# EAGLE design PCB_Draft_4 (EAGLE 9.6.2)
AUTHOR: R. Hall, A. Singh, K.Quizon; BOARD_NAME: ESP32 I2C Exp / M Driver; DOC_NUM: 0; PROJECT_NAME: R8-O7 PCB; REVISION: 6
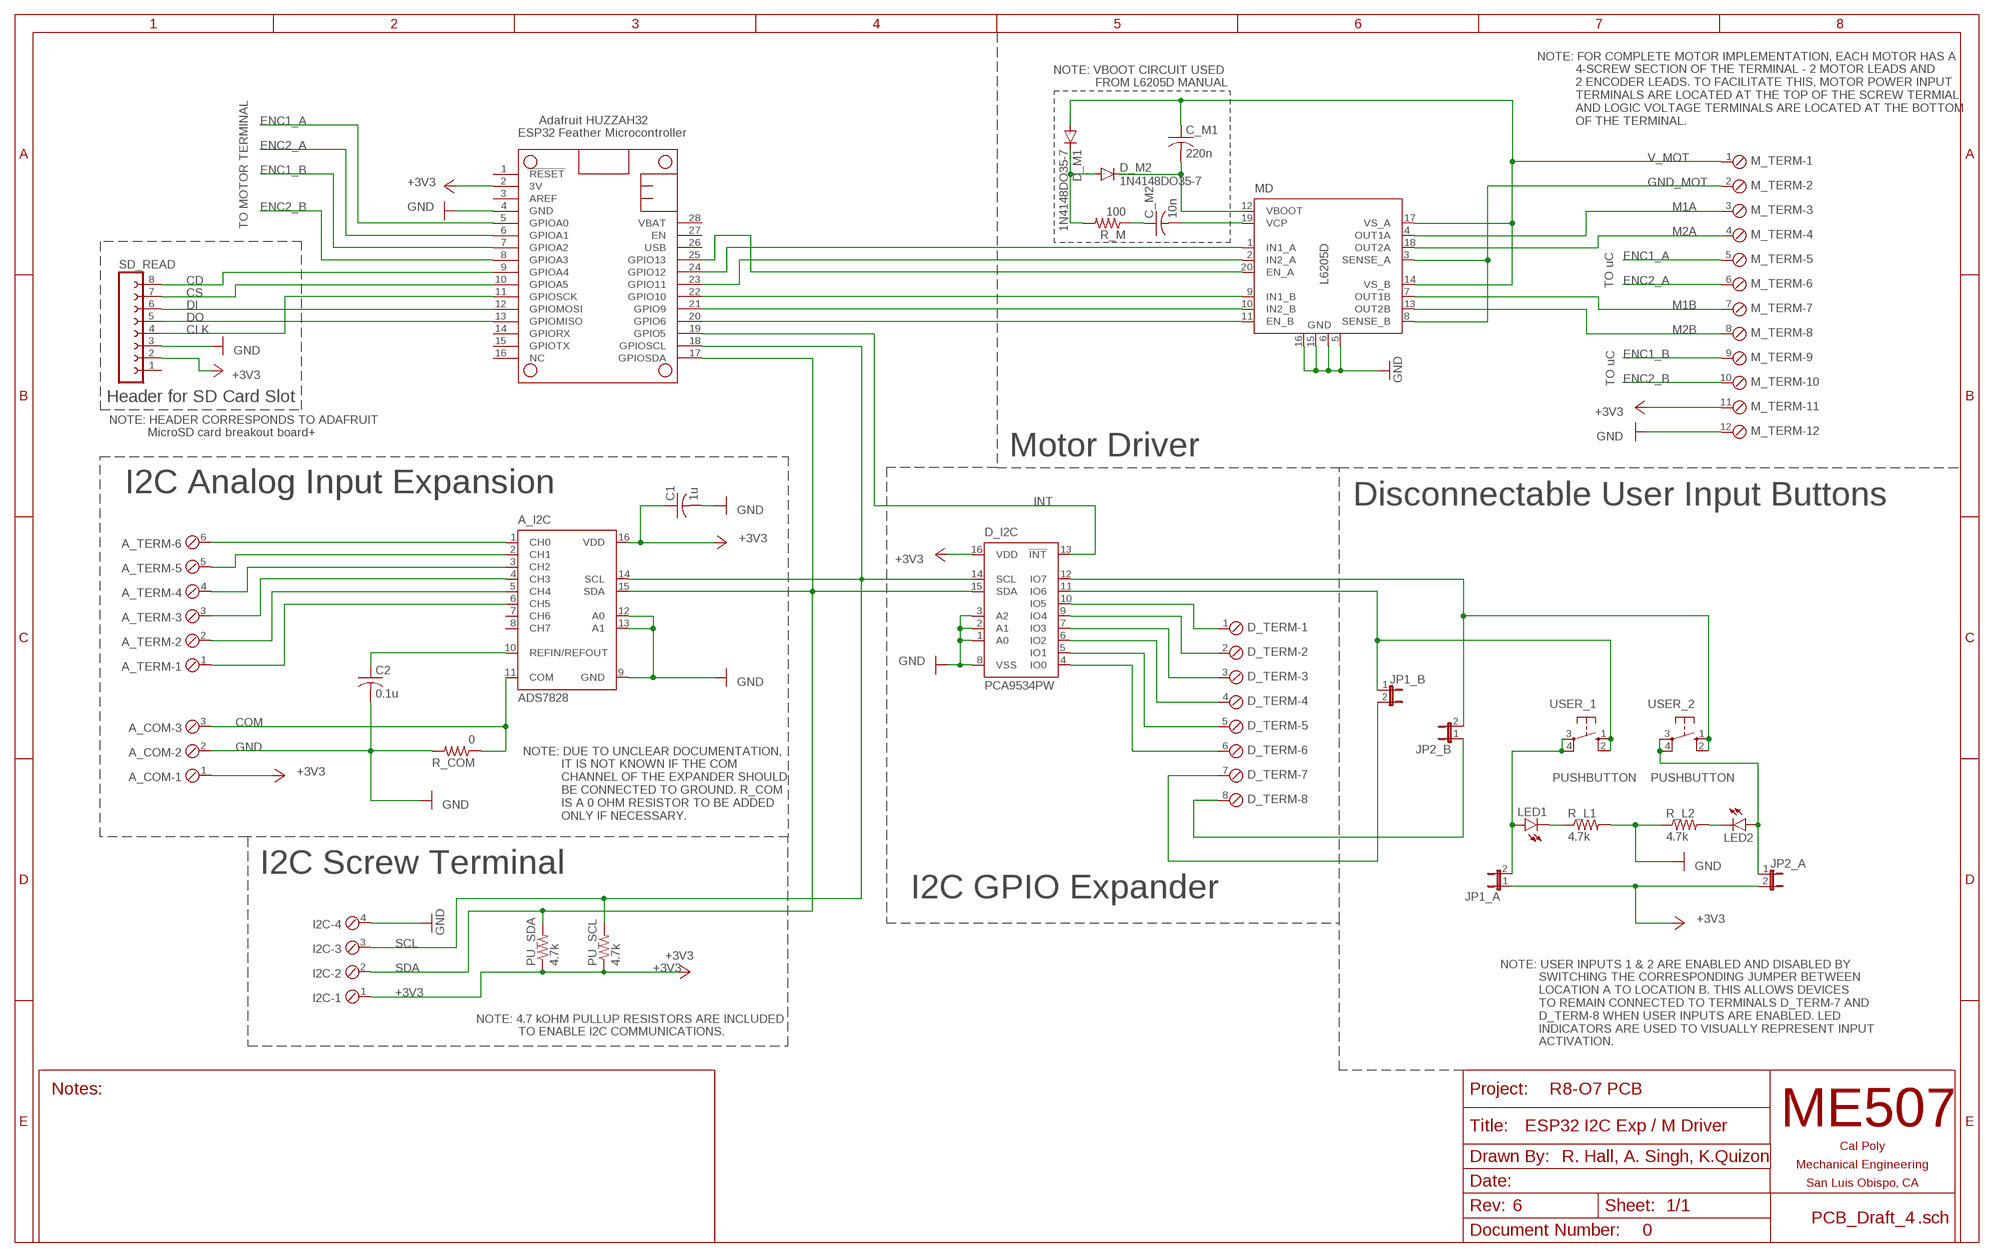
[diagram p0: schematic, sheet 1]

## Parts
A_COM  SCREWTERM_3P_254  [3POL254]
A_I2C  ADS7828  [TSSOP16-PW]
A_TERM  SCREWTERM_6P_254  [6POL254]
C1  1u  C-USC0805  [C0805]
C2  0.1u  C-USC0805  [C0805]
C_M1  220n  C-USC0805  [C0805]
C_M2  10n  C-USC0805  [C0805]
D_I2C  PCA9534PW  [TSSOP16]
D_M1  1N4148DO35-7  [DO35-7]
D_M2  1N4148DO35-7  [DO35-7]
D_TERM  SCREWTERM_8P_254  [8POL254]
FTHRWNG  FEATHERWINGEXTENDED_BOTH_ENDS  [FEATHERWING]
I2C  SCREWTERM_4P_254  [4POL254]
JP1_A  JP1E  [JP1]
JP1_B  JP1E  [JP1]
JP2_A  JP1E  [JP1]
JP2_B  JP1E  [JP1]
LED1  LEDCHIP-LED0805  [CHIP-LED0805]
LED2  LEDCHIP-LED0805  [CHIP-LED0805]
M_TERM  SCREWTERM_12P_254  [12POL254]
MD  L6205D  [SO20]
PU_SCL  4.7k  R-US_M0805  [M0805]
PU_SDA  4.7k  R-US_M0805  [M0805]
R_COM  0  R-US_M0805  [M0805]
R_L1  4.7k  R-US_M0805  [M0805]
R_L2  4.7k  R-US_M0805  [M0805]
R_M  100  R-US_M0805  [M0805]
SD_READ  FE08-1  [FE08]
USER_1  PUSHBUTTON  [B3F-10XX]
USER_2  PUSHBUTTON  [B3F-10XX]

## Nets
+3V3: A_COM.1 A_I2C.16(VDD) C1.1 D_I2C.16(VDD) FTHRWNG.2(3V) I2C.1 JP1_A.1 JP2_A.2 M_TERM.11 PU_SCL.1 PU_SDA.1 SD_READ.2
CD: FTHRWNG.9(GPIOA4) SD_READ.8
CLK: FTHRWNG.11(GPIOSCK) SD_READ.4
COM: A_COM.3 A_I2C.11(COM) R_COM.1
CS: FTHRWNG.10(GPIOA5) SD_READ.7
DI: FTHRWNG.12(GPIOMOSI) SD_READ.6
DO: FTHRWNG.13(GPIOMISO) SD_READ.5
ENC1_A: FTHRWNG.5(GPIOA0) M_TERM.5
ENC1_B: FTHRWNG.7(GPIOA2) M_TERM.9
ENC2_A: FTHRWNG.6(GPIOA1) M_TERM.6
ENC2_B: FTHRWNG.8(GPIOA3) M_TERM.10
GND: A_COM.2 A_I2C.9(GND) A_I2C.12(A0) A_I2C.13(A1) C1.2 C2.2 D_I2C.1(A0) D_I2C.2(A1) D_I2C.3(A2) D_I2C.8(VSS) FTHRWNG.4(GND) I2C.4 M_TERM.12 MD.5(GND) MD.6(GND) MD.15(GND) MD.16(GND) R_COM.2 R_L1.2 R_L2.1 SD_READ.3
GND_MOT: M_TERM.2 MD.3(SENSE_A) MD.8(SENSE_B)
INT: D_I2C.13(!INT) FTHRWNG.19(GPIO5)
M1A: M_TERM.3 MD.4(OUT1A)
M1B: M_TERM.7 MD.7(OUT1B)
M2A: M_TERM.4 MD.18(OUT2A)
M2B: M_TERM.8 MD.13(OUT2B)
N$1: D_I2C.12(IO7) JP2_B.2 USER_2.1(S) USER_2.2(S1)
N$2: D_I2C.11(IO6) JP1_B.1 USER_1.1(S) USER_1.2(S1)
N$3: D_I2C.10(IO5) D_TERM.1
N$4: D_I2C.9(IO4) D_TERM.2
N$5: D_I2C.7(IO3) D_TERM.3
N$6: D_I2C.6(IO2) D_TERM.4
N$8: D_TERM.7 JP1_B.2
N$9: A_I2C.1(CH0) A_TERM.6
N$10: A_I2C.2(CH1) A_TERM.5
N$11: A_I2C.3(CH2) A_TERM.4
N$12: A_I2C.4(CH3) A_TERM.3
N$13: A_I2C.5(CH4) A_TERM.2
N$14: A_I2C.6(CH5) A_TERM.1
N$17: A_I2C.10(REFIN/REFOUT) C2.1
N$18: FTHRWNG.20(GPIO6) MD.11(EN_B)
N$20: FTHRWNG.21(GPIO9) MD.10(IN2_B)
N$21: FTHRWNG.22(GPIO10) MD.9(IN1_B)
N$22: FTHRWNG.23(GPIO11) MD.2(IN2_A)
N$23: FTHRWNG.24(GPIO12) MD.1(IN1_A)
N$25: FTHRWNG.25(GPIO13) MD.20(EN_A)
N$26: JP1_A.2 LED1.A USER_1.3(P) USER_1.4(P1)
N$27: JP2_A.1 LED2.A USER_2.3(P) USER_2.4(P1)
N$29: LED1.C R_L1.1
N$30: LED2.C R_L2.2
N$32: D_I2C.5(IO1) D_TERM.5
N$33: D_I2C.4(IO0) D_TERM.6
N$35: D_TERM.8 JP2_B.1
N$44: C_M2.1 R_M.1
N$45: D_M1.C D_M2.A R_M.2
SCL: A_I2C.14(SCL) D_I2C.14(SCL) FTHRWNG.18(GPIOSCL) I2C.3 PU_SCL.2
SDA: A_I2C.15(SDA) D_I2C.15(SDA) FTHRWNG.17(GPIOSDA) I2C.2 PU_SDA.2
V_MOT: C_M1.1 D_M1.A M_TERM.1 MD.14(VS_B) MD.17(VS_A)
VBOOT: C_M1.2 D_M2.C MD.12(VBOOT)
VCP: C_M2.2 MD.19(VCP)
Unconnected: A_I2C.7(CH6) A_I2C.8(CH7) FTHRWNG.1(!RESET) FTHRWNG.3(AREF) FTHRWNG.14(GPIORX) FTHRWNG.15(GPIOTX) FTHRWNG.16(NC) FTHRWNG.26(USB) FTHRWNG.27(EN) FTHRWNG.28(VBAT) SD_READ.1

## Notes on the sheet
- NOTE: VBOOT CIRCUIT USED 
              FROM L6205D MANUAL
- NOTE: FOR COMPLETE MOTOR IMPLEMENTATION, EACH MOTOR HAS A 
             4-SCREW SECTION OF THE TERMINAL - 2 MOTOR LEADS AND 
             2 ENCODER LEADS. TO FACILITATE THIS, MOTOR POWER INPUT 
             TERMINALS ARE LOCATED AT THE TOP OF THE SCREW TERMIAL 
             AND LOGIC VOLTAGE TERMINALS ARE LOCATED AT THE BOTTOM 
             OF THE TERMINAL.
- Adafruit HUZZAH32
  ESP32 Feather Microcontroller
- TO MOTOR TERMINAL
- TO uC
- TO uC
- Header for SD Card Slot
- NOTE: HEADER CORRESPONDS TO ADAFRUIT
             MicroSD card breakout board+
- Motor Driver
- I2C Analog Input Expansion
- Disconnectable User Input Buttons
- NOTE: DUE TO UNCLEAR DOCUMENTATION, 
             IT IS NOT KNOWN IF THE COM 
             CHANNEL OF THE EXPANDER SHOULD 
             BE CONNECTED TO GROUND. R_COM 
             IS A 0 OHM RESISTOR TO BE ADDED 
             ONLY IF NECESSARY.
- I2C Screw Terminal
- I2C GPIO Expander
- NOTE: 4.7 kOHM PULLUP RESISTORS ARE INCLUDED 
              TO ENABLE I2C COMMUNICATIONS.
- NOTE: USER INPUTS 1 & 2 ARE ENABLED AND DISABLED BY   
             SWITCHING THE CORRESPONDING JUMPER BETWEEN 
             LOCATION A TO LOCATION B. THIS ALLOWS DEVICES 
             TO REMAIN CONNECTED TO TERMINALS D_TERM-7 AND 
             D_TERM-8 WHEN USER INPUTS ARE ENABLED. LED 
             INDICATORS ARE USED TO VISUALLY REPRESENT INPUT 
             ACTIVATION.

## Library data of the parts
A_COM = ME507:SCREWTERM_3P: Screw Terminal Block This part is designed for a screw terminal connector. The 2.54mm (0.100 inch) foorprint can also be used for male or female pin headers such as those on most development boards. One can also solder wires directly into the holes, though this makes modifications or repairs to the system more inconvenient. Larger versions can carry more current.
A_I2C = burr-brown:ADS7828: 12-Bit, 8-Channel Sampling ANALOG-TO-DIGITAL CONVERTER with I2C? Interface Source: www.ti.com .. ADS7828.pdf; MF: TEXAS INSTRUMENTS; MPN: ADS7828E/250; OC_FARNELL: 1470338; OC_NEWARK: 74C7158
A_TERM = ME507:SCREWTERM_6P: Screw Terminal Block This part is designed for a screw terminal connector. The 2.54mm (0.100 inch) foorprint can also be used for male or female pin headers such as those on most development boards. One can also solder wires directly into the holes, though this makes modifications or repairs to the system more inconvenient. Larger versions can carry more current.
C1 C2 C_M1 C_M2 = rcl:C-US: CAPACITOR, American symbol; SPICEPREFIX: C
D_I2C = micro-philips:PCA9534: 8-bit I2C-bus and SMBus low power I/O port with interrupt Source: www.nxp.com .. PCA9534_3.pdf; MPN: PCA9534PW; OC_FARNELL: 1408285; OC_NEWARK: 18M7516
D_M1 D_M2 = diode:1N4148: DIODE high speed (Philips)
D_TERM = ME507:SCREWTERM_8P: Screw Terminal Block This part is designed for a screw terminal connector. The 2.54mm (0.100 inch) foorprint can also be used for male or female pin headers such as those on most development boards. One can also solder wires directly into the holes, though this makes modifications or repairs to the system more inconvenient. Larger versions can carry more current.
FTHRWNG = ME507:FEATHERWING: AdaFruitTM Feather Wing A modified version of a Featherwing, the add-on board for an AdaFruit(tm) Feather development board. There is a standard size version which is the same size as the Feather board on which the microcontroller hangs out. There is also an extended version, with each and longer by a quarter inch to allow for connectors such as screw terminals which aren't hidden under another board if this wing isn't on the top of the board stack. The pins are named in a generic fashion; these names do not necessarily correspond to Arduino or Python pin numbers. The designer must refer to the pinout diagram for each specific Feather board to find the functions of each pin.
I2C = ME507:SCREWTERM_4P: Screw Terminal Block This part is designed for a screw terminal connector. The 2.54mm (0.100 inch) foorprint can also be used for male or female pin headers such as those on most development boards. One can also solder wires directly into the holes, though this makes modifications or repairs to the system more inconvenient. Larger versions can carry more current.
JP1_A JP1_B JP2_A JP2_B = jumper:JP1E: JUMPER
LED1 LED2 = led:LED: LED OSRAM: - CHIPLED LG R971, LG N971, LY N971, LG Q971, LY Q971, LO R971, LY R971 LH N974, LH R974 LS Q976, LO Q976, LY Q976 LO Q996 - Hyper CHIPLED LW Q18S LB Q993, LB Q99A, LB R99A - SideLED LS A670, LO A670, LY A670, LG A670, LP A670 LB A673, LV A673, LT A673, LW A673 LH A674 LY A675 LS A676, LA A676, LO A676, LY A676, LW A676 LS A679, LY A679, LG A679 - Hyper Micro SIDELED® LS Y876, LA Y876, LO Y876, LY Y876 LT Y87S - SmartLED LW L88C, LW L88S LB L89C, LB L89S, LG L890 LS L89K, LO L89K, LY L89K LS L896, LA L896, LO L896, LY L896 - TOPLED LS T670, LO T670, LY T670, LG T670, LP T670 LSG T670, LSP T670, LSY T670, LOP T670, LYG T670 LG T671, LOG T671, LSG T671 LB T673, LV T673, LT T673, LW T673 LH T674 LS T676, LA T676, LO T676, LY T676, LB T676, LH T676, LSB T676, LW T676 LB T67C, LV T67C, LT T67C, LS T67K, LO T67K, LY T67K, LW E67C LS E67B, LA E67B, LO E67B, LY E67B, LB E67C, LV E67C, LT E67C LW T67C LS T679, LY T679, LG T679 LS T770, LO T770, LY T770, LG T770, LP T770 LB T773, LV T773, LT T773, LW T773 LH T774 LS E675, LA E675, LY E675, LS T675 LS T776, LA T776, LO T776, LY T776, LB T776 LHGB T686 LT T68C, LB T68C - Hyper Mini TOPLED® LB M676 - Mini TOPLED Santana® LG M470 LS M47K, LO M47K, LY M47K Source: http://www.osram.convergy.de LUXEON: - LUMILED® LXK2-PW12-R00, LXK2-PW12-S00, LXK2-PW14-U00, LXK2-PW14-V00 LXK2-PM12-R00, LXK2-PM12-S00, LXK2-PM14-U00 LXK2-PE12-Q00, LXK2-PE12-R00, LXK2-PE12-S00, LXK2-PE14-T00, LXK2-PE14-U00 LXK2-PB12-K00, LXK2-PB12-L00, LXK2-PB12-M00, LXK2-PB14-N00, LXK2-PB14-P00, LXK2-PB14-Q00 LXK2-PR12-L00, LXK2-PR12-M00, LXK2-PR14-Q00, LXK2-PR14-R00 LXK2-PD12-Q00, LXK2-PD12-R00, LXK2-PD12-S00 LXK2-PH12-R00, LXK2-PH12-S00 LXK2-PL12-P00, LXK2-PL12-Q00, LXK2-PL12-R00 Source: www.luxeon.com KINGBRIGHT: KA-3528ASYC Source: www.kingbright.com
M_TERM = ME507:SCREWTERM_12P: Screw Terminal Block This part is designed for a screw terminal connector. The 2.54mm (0.100 inch) foorprint can also be used for male or female pin headers such as those on most development boards. One can also solder wires directly into the holes, though this makes modifications or repairs to the system more inconvenient. Larger versions can carry more current.
MD = st-microelectronics:L6205: DUAL DMOS FULL BRIDGE MOTOR DRIVER; MPN: L6205D; OC_FARNELL: unknown; OC_NEWARK: 37M3487
PU_SCL PU_SDA R_COM R_L1 R_L2 R_M = rcl:R-US_: RESISTOR, American symbol; SPICEPREFIX: R
SD_READ = con-lsta:FE08-1: FEMALE HEADER; OC_FARNELL: unknown; OC_NEWARK: unknown
USER_1 USER_2 = ME507:PUSHBUTTON: OMRON SWITCH; MPN: B3F-1000; OC_FARNELL: 176432; OC_NEWARK: 36M3542

## Board
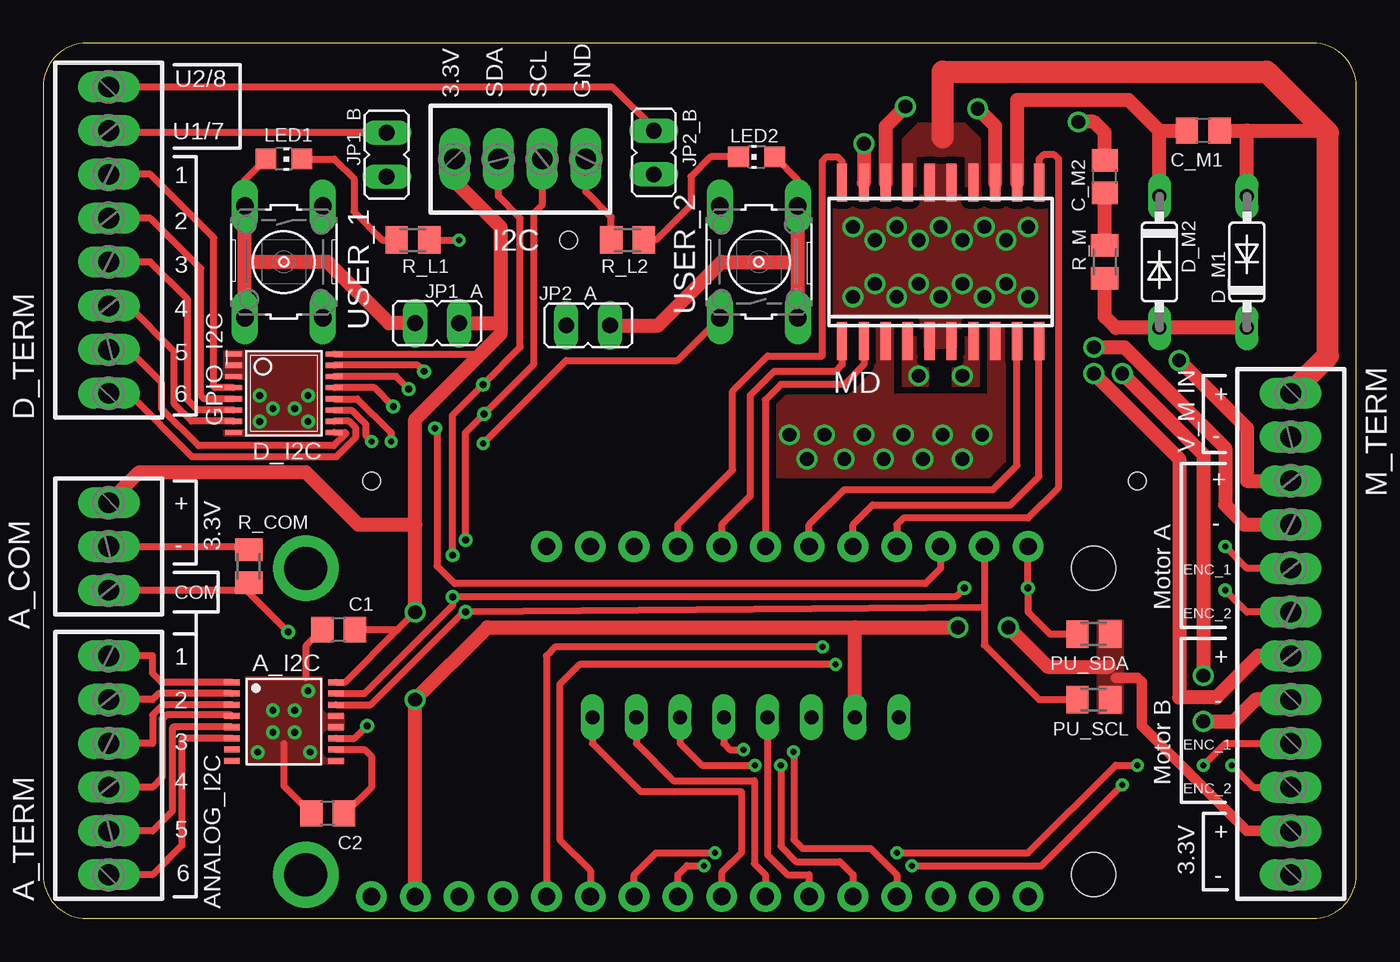
[diagram p1: board, top side]
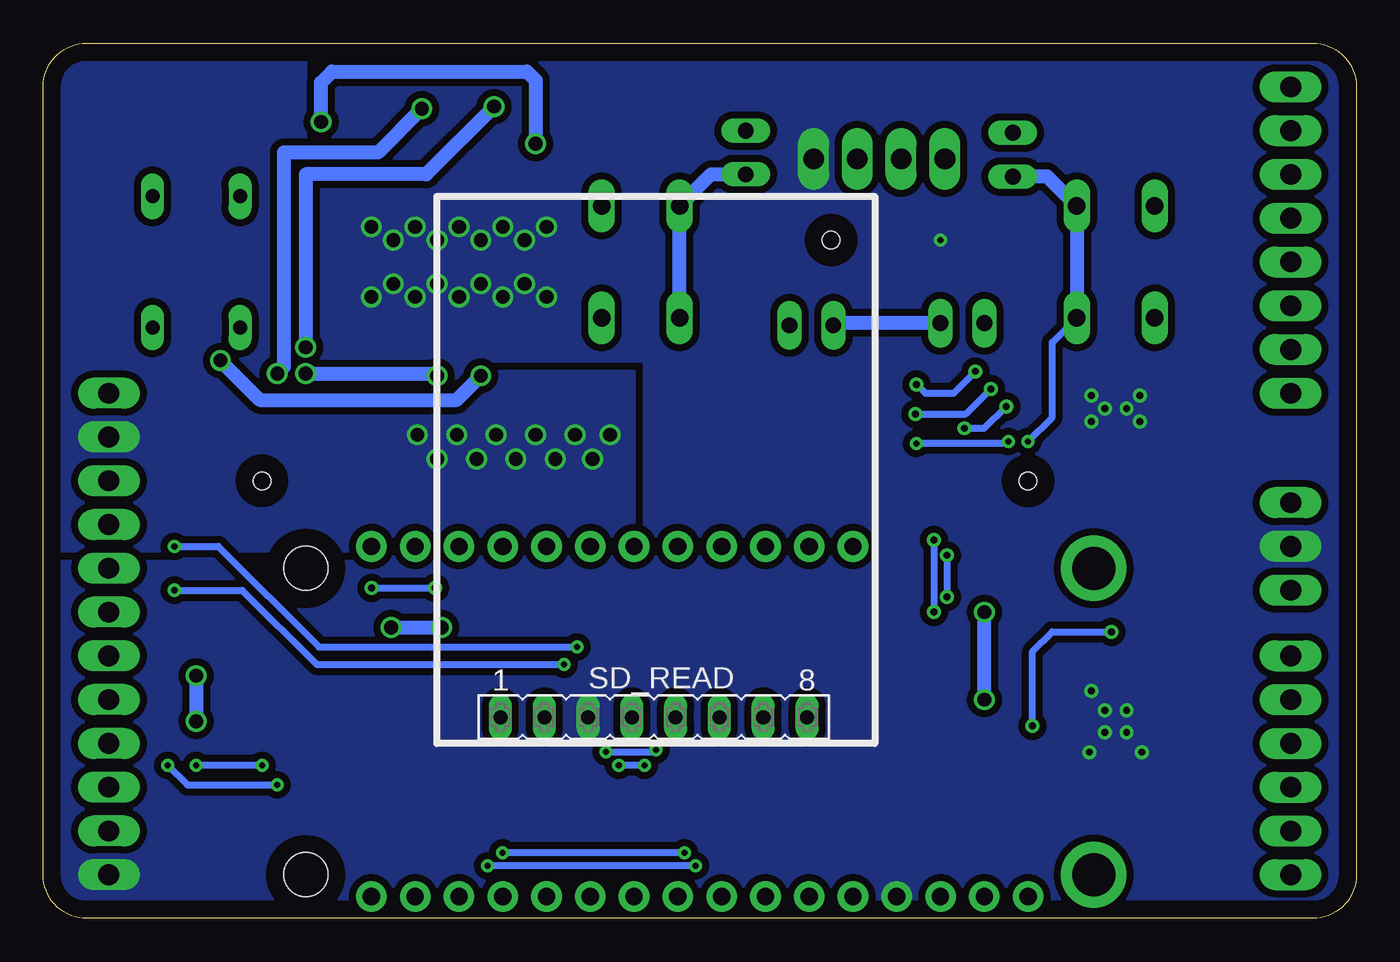
[diagram p2: board, bottom side, seen from below]

Size 76.2 x 50.8 mm. Coordinates in mm from the lower left corner, seen from the top.
Copper layers (1*16): Top 0.035mm / dielectric 1.5mm / Bottom 0.035mm
Design rules "default": minimum track width 6mil, minimum drill 0.35mm, track to track 6mil, track to pad 6mil, pad to pad 6mil, via to via 6mil, smd to smd 6mil, copper to edge 40mil, drill to drill 6mil, minimum pad ring 10mil, minimum via ring 8mil, stop-mask expansion 4mil, vias tented up to drill 0mil, thermal gap 10mil
Holes 1 mm at 30.48,39.37 19.05,25.4 63.5,25.4

### Footprints (pad centres in the part's own frame; a part is rotated, then mirrored left to right if it is on the bottom)
3POL254 = drill 1.2 long: 1 -2.54,0; 2 0,0; 3 2.54,0
TSSOP16-PW = smd 0.35 x 0.9: 1 -2.275,-3.025; 2 -1.625,-3.025; 3 -0.975,-3.025; 4 -0.325,-3.025; 5 0.325,-3.025; 6 0.975,-3.025; 7 1.625,-3.025; 8 2.275,-3.025; 9 2.275,3.025; 10 1.625,3.025; 11 0.975,3.025; 12 0.325,3.025; 13 -0.325,3.025; 14 -0.975,3.025; 15 -1.625,3.025; 16 -2.275,3.025
6POL254 = drill 1.2 pad 1.778 long: 1 -6.35,0; 2 -3.81,0; 3 -1.27,0; 4 1.27,0; 5 3.81,0; 6 6.35,0
C0805 = smd 1.3 x 1.5: 1 -0.95,0; 2 0.95,0
TSSOP16 = smd 0.305 x 0.991: 1 -2.275,-2.918; 2 -1.625,-2.918; 3 -0.975,-2.918; 4 -0.325,-2.918; 5 0.325,-2.918; 6 0.975,-2.918; 7 1.625,-2.918; 8 2.275,-2.918; 9 2.275,2.918; 10 1.625,2.918; 11 0.975,2.918; 12 0.325,2.918; 13 -0.325,2.918; 14 -0.975,2.918; 15 -1.625,2.918; 16 -2.275,2.918
DO35-7 = drill 0.813 long: A 3.81,0; C -3.81,0
8POL254 = drill 1.2 long: 1 -8.89,0; 2 -6.35,0; 3 -3.81,0; 4 -1.27,0; 5 1.27,0; 6 3.81,0; 7 6.35,0; 8 8.89,0
FEATHERWING = drill 1 pad 1.778: 1 6.35,1.27; 2 8.89,1.27; 3 11.43,1.27; 4 13.97,1.27; 5 16.51,1.27; 6 19.05,1.27; 7 21.59,1.27; 8 24.13,1.27; 9 26.67,1.27; 10 29.21,1.27; 11 31.75,1.27; 12 34.29,1.27; 13 36.83,1.27; 14 39.37,1.27; 15 41.91,1.27; 16 44.45,1.27; 17 44.45,21.59; 18 41.91,21.59; 19 39.37,21.59; 20 36.83,21.59; 21 34.29,21.59; 22 31.75,21.59; 23 29.21,21.59; 24 26.67,21.59; 25 24.13,21.59; 26 21.59,21.59; 27 19.05,21.59; 28 16.51,21.59 | drill 2.5 pad 3.81: P$1 2.54,20.32; P$2 2.54,2.54 | hole 2.54: 48.26,20.32; 48.26,2.54
4POL254 = drill 1.2 long: 1 -3.81,0; 2 -1.27,0; 3 1.27,0; 4 3.81,0
JP1 = drill 0.914 long: 1 0,-1.27; 2 0,1.27
CHIP-LED0805 = smd 1.2 x 1.2: A 0,-1.05; C 0,1.05
12POL254 = drill 1.2 long: 1 -13.97,0; 2 -11.43,0; 3 -8.89,0; 4 -6.35,0; 5 -3.81,0; 6 -1.27,0; 7 1.27,0; 8 3.81,0; 9 6.35,0; 10 8.89,0; 11 11.43,0; 12 13.97,0
SO20 = smd 0.6 x 2.2: 1 -5.715,-4.6; 2 -4.445,-4.6; 3 -3.175,-4.6; 4 -1.905,-4.6; 5 -0.635,-4.6; 6 0.635,-4.6; 7 1.905,-4.6; 8 3.175,-4.6; 9 4.445,-4.6; 10 5.715,-4.6; 11 5.715,4.6; 12 4.445,4.6; 13 3.175,4.6; 14 1.905,4.6; 15 0.635,4.6; 16 -0.635,4.6; 17 -1.905,4.6; 18 -3.175,4.6; 19 -4.445,4.6; 20 -5.715,4.6
M0805 = smd 1.3 x 1.6: 1 -0.95,0; 2 0.95,0
FE08 = drill 0.813 long: 1 -8.89,0; 2 -6.35,0; 3 -3.81,0; 4 -1.27,0; 5 1.27,0; 6 3.81,0; 7 6.35,0; 8 8.89,0
B3F-10XX = drill 1.016 long: 1 -3.251,2.261; 2 3.251,2.261; 3 -3.251,-2.261; 4 3.251,-2.261

### Placement (x,y rotation side)
A_COM  3.81,21.59 270 top
A_I2C  13.97,11.43 270 top
A_TERM  3.81,8.89 90 top
C1  17.14,16.76 180 top
C2  16.51,6.1 180 top
C_M1  67.31,45.72 180 top
C_M2  61.59,43.05 90 top
D_I2C  13.97,30.48 270 top
D_M1  69.85,38.1 90 top
D_M2  64.77,38.1 270 top
D_TERM  3.81,39.37 90 top
FTHRWNG  12.7,0 0 top
I2C  27.69,44.07 0 top
JP1_A  22.86,34.54 90 top
JP1_B  19.94,44.32 0 top
JP2_A  31.62,34.42 90 top
JP2_B  35.43,44.45 180 top
LED1  13.97,44.07 270 top
LED2  41.4,44.2 90 top
M_TERM  72.39,16.51 270 top
MD  52.07,38.1 0 top
PU_SCL  60.96,12.7 180 top
PU_SDA  60.96,16.51 180 top
R_COM  11.94,20.45 90 top
R_L1  21.46,39.37 0 top
R_L2  33.91,39.37 0 top
R_M  61.59,38.1 270 top
SD_READ  40.77,11.68 0 bottom
USER_1  13.97,38.1 270 top
USER_2  41.53,38.1 90 top

### Tracks (layer width: path | path; a pad name or v marks a point on that pad's centre or on a via)
+3V3  (via drill 0.8)
  Top 0.406: A_I2C.16 17.52,13.71 20.57,16.76 | 20.57,16.76 v21.59,17.78 | C1.1 20.57,16.76 | D_I2C.16 25.28,32.76 25.34,32.7
  Top 0.61: M_TERM.11 69.85,5.08 63.75,11.18 63.75,13.72 63.5,13.97 62.23,13.97
  Top 0.813: FTHRWNG.2 v21.59,12.7 25.78,16.89 47.12,16.89 | 47.12,16.89 v53.09,16.89 | v21.59,17.78 21.59,22.86 | 21.59,22.86 21.59,28.96 25.34,32.7 26.54,33.91 26.54,34.54 | I2C.1 23.88,42.8 26.54,40.13 26.54,34.54 | A_COM.1 5.59,25.91 15.24,25.91 18.29,22.86 21.59,22.86 | SD_READ.2 47.12,16.89 | 62.16,12.95 PU_SCL.1 61.85,12.76 | v56.01,16.89 58.29,14.61 61.85,14.61 | 61.98,16.44 PU_SDA.1 | JP1_A.1 26.54,34.54
  Bottom 0.813: v21.59,12.7 v21.59,17.78 | v56.01,16.89 v53.09,16.89 | JP1_A.1 30.23,34.54 JP2_A.2
  pour Top (no thermals): 61.21,17.27 61.21,11.94 62.61,11.94 62.61,17.27
CD
  Top 0.406: SD_READ.8 31.88,10.16 34.67,7.37 40.51,7.37 40.51,3.81 39.37,2.67 FTHRWNG.9
CLK
  Top 0.406: SD_READ.4 42.04,3.68 43.18,2.54 44.45,2.54 FTHRWNG.11
COM  (via drill 0.4)
  Top 0.406: A_I2C.11 18.07,10.46 v18.8,11.18 | v14.22,16.64 11.94,18.92 R_COM.1 11.49,19.05 A_COM.3
  Bottom 0.406: v18.8,11.18 18.8,15.49 17.65,16.64 v14.22,16.64
CS
  Top 0.406: SD_READ.7 34.42,10.16 36.58,8 41.27,8 41.27,3.17 41.91,2.54 FTHRWNG.10
DI  (via drill 0.35)
  Top 0.406: SD_READ.6 36.96,10.16 38.23,8.89 v41.3,8.89 | v42.8,8.89 42.8,4.19 43.69,3.3 46.23,3.3 46.99,2.54 FTHRWNG.12
  Bottom 0.406: v41.3,8.89 v42.8,8.89
DO  (via drill 0.35)
  Top 0.406: SD_READ.5 39.5,10.16 39.86,9.8 v40.64,9.8 | v43.53,9.67 43.56,9.64 43.56,4.57 44.07,4.06 48.01,4.06 49.53,2.54 FTHRWNG.13
  Bottom 0.406: v43.53,9.67 40.77,9.67 v40.64,9.8
ENC1_A  (via drill 0.35)
  Top 0.406: M_TERM.5 69.85,20.32 v68.58,21.59 | v45.21,15.75 29.72,15.75 29.21,15.24 FTHRWNG.5
  Bottom 0.406: v68.58,21.59 66.04,21.59 60.2,15.75 v45.21,15.75
ENC1_B  (via drill 0.35)
  Top 0.406: FTHRWNG.7 34.29,2.54 35.56,3.81 v38.99,3.81 | v49.53,3.81 57.15,3.81 62.23,8.89 v63.5,8.89 | v67.31,8.89 68.58,10.16 M_TERM.9
  Bottom 0.406: v38.99,3.81 v49.53,3.81 | v63.5,8.89 v67.31,8.89
ENC2_A  (via drill 0.35)
  Top 0.406: M_TERM.6 69.85,17.78 v68.58,19.05 | v45.97,14.73 31.11,14.73 29.97,13.59 29.97,4.57 31.75,2.79 FTHRWNG.6
  Bottom 0.406: v68.58,19.05 64.64,19.05 60.33,14.73 v45.97,14.73
ENC2_B  (via drill 0.35)
  Top 0.406: FTHRWNG.8 36.83,2.54 37.35,3.06 v38.34,3.06 | v50.42,3.05 57.91,3.05 v62.61,7.75 | M_TERM.10 70.23,7.62 v68.96,8.89
  Bottom 0.406: v38.34,3.06 50.41,3.06 v50.42,3.05 | v62.61,7.75 67.82,7.75 v68.96,8.89
GND  (via drill 0.35, 0.4, 0.8)
  Top 0.406: C2.2 13.97,7.69 13.97,10.16 | C1.2 15.24,15.81 15.24,13.97 | A_COM.2 11.74,21.59 R_COM.2 | R_L1.2 v24.13,39.37 | R_L2.1 32.96,40.7 31.5,42.16 I2C.4
  other vias: 46.99,40.13 48.26,39.37 49.53,40.13 50.8,39.37 52.07,40.13 53.34,39.37 54.61,40.13 55.88,39.37 57.15,40.13 57.15,36.07 55.88,36.83 54.61,36.07 53.34,36.83 52.07,36.07 50.8,36.83 49.53,36.07 48.26,36.83 46.99,36.07 15.37,30.35 14.61,29.59 15.37,28.83 13.34,29.59 12.57,28.83 12.57,30.35 15.37,13.21 13.34,12.06 12.45,9.65 15.49,9.65 13.34,10.79 14.61,10.79 14.61,12.06
  pour Bottom (isolate 0.406, rank 6, no thermals): 0,50.8 0,0 76.2,0 76.2,50.8
  pour Top (isolate 0.406, no thermals): 45.72,41.91 51.18,41.91 51.18,43.69 52.96,43.69 52.96,41.91 58.42,41.91 58.42,34.29 52.96,34.29 52.96,33.15 51.18,33.15 51.18,34.29 45.72,34.29
  pour Top (isolate 0.305, no thermals): 10.54,28.07 10.54,32.89 17.4,32.89 17.4,28.07
  pour Top (isolate 0.305, no thermals): 10.67,13.97 17.4,13.97 17.4,9.02 10.67,9.02
GND_MOT  (via drill 0.8)
  other vias: 49.91,28.07 52.2,28.07 54.48,28.07 53.34,26.67 51.05,26.67 48.77,26.67 47.62,28.07 46.48,26.67 45.34,28.07 44.32,26.67 43.31,28.07
  pour Bottom (isolate 0.406, no thermals): 60.96,50.8 60.96,31.75 41.91,31.75 41.91,21.34 76.2,21.34 76.2,50.8
  pour Top (isolate 0.406, rank 4, no thermals): 48.13,34.67 49.28,34.67 49.28,30.35 54.86,30.35 54.86,34.54 56.13,34.54 56.13,26.42 55.37,25.65 41.91,25.65 41.91,31.75 48.13,31.75
INT  (via drill 0.4)
  Top 0.406: FTHRWNG.19 52.07,20.32 51.18,19.43 23.88,19.43 22.86,20.45 22.86,28.32 v22.73,28.45 | v20.32,29.72 19.23,30.8 D_I2C.13
  Bottom 0.406: v22.73,28.45 21.59,28.45 v20.32,29.72
M1A  (via drill 0.8)
  Top 0.813: v65.91,32.38 69.85,28.45 69.85,25.4 M_TERM.3
  Bottom 0.813: v50.8,31.5 52.2,30.1 63.63,30.1 v65.91,32.38
  pour Top (isolate 0.406, rank 6, no thermals): 49.91,34.54 49.91,30.73 51.31,30.73 51.31,34.54
M1B  (via drill 0.8)
  Top 0.813: M_TERM.7 70.48,15.24 68.07,12.83 65.91,12.83 65.91,26.67 v60.96,31.62
  Bottom 0.813: v60.96,31.62 53.47,31.62 v53.34,31.5
  pour Top (isolate 0.406, rank 6, no thermals): 54.36,34.54 54.36,30.73 52.83,30.73 52.83,34.54
M2A  (via drill 0.8)
  Top 0.813: MD.18 48.9,45.97 v50.04,47.12 | v60.96,33.15 62.74,33.15 68.58,27.3 68.58,24 69.72,22.86 M_TERM.4
  Bottom 0.813: v50.04,47.12 53.98,43.18 60.96,43.18 v60.96,33.15
M2B  (via drill 0.8)
  Top 0.813: MD.13 55.24,45.97 v54.23,46.99 | v62.61,31.62 67.31,26.92 v67.31,14.1 | v67.31,11.43 69.09,11.43 70.36,12.7 M_TERM.8
  Bottom 0.813: v54.23,46.99 56.77,44.45 62.23,44.45 62.23,32 v62.61,31.62 | v67.31,14.1 v67.31,11.43
N$1  (via drill 0.35)
  Top 0.406: D_I2C.12 18.23,30.16 20.19,28.19 v20.19,27.69 | USER_2.1 36.8,32.38 30.35,32.38 v25.53,27.56
  Bottom 0.406: v20.19,27.69 20.32,27.56 v25.53,27.56
  Bottom 0.813: USER_2.1 USER_2.2 37.44,43.18 JP2_B.2
N$2  (via drill 0.35)
  Top 0.406: v19.05,27.69 18.72,28.02 18.72,28.68 17.89,29.5 D_I2C.11
  Bottom 0.406: v19.05,27.69 17.65,29.08 17.65,33.43 USER_1.2
  Bottom 0.813: USER_1.2 USER_1.1 17.93,43.05 JP1_B.1
N$3
  Top 0.406: D_I2C.10 17.75,28.86 18.16,28.45 18.16,27.94 17.02,26.8 8.64,26.8 4.95,30.48 D_TERM.1
N$4
  Top 0.406: D_I2C.9 17.52,28.2 17.57,28.14 16.86,27.43 9.02,27.43 6.86,29.59 6.86,31.11 4.95,33.02 D_TERM.2
N$5
  Top 0.406: D_I2C.7 8.61,28.86 7.62,29.84 7.62,32.89 4.95,35.56 D_TERM.3
N$6
  Top 0.406: D_I2C.6 8.98,29.5 8.38,30.1 8.38,35.94 6.22,38.1 D_TERM.4
N$8
  Top 0.406: JP1_B.2 3.94,45.59 D_TERM.7
N$9
  Top 0.406: A_TERM.6 6.35,15.24 6.35,14.22 6.87,13.71 A_I2C.1
N$10
  Top 0.406: A_TERM.5 6.35,12.7 6.71,13.05 A_I2C.2
N$11
  Top 0.406: A_TERM.4 6.35,10.16 6.35,11.81 6.94,12.4 A_I2C.3
N$12
  Top 0.406: A_I2C.4 10.89,11.81 7.16,11.81 6.91,11.56 6.91,8.18 6.35,7.62 A_TERM.3
N$13
  Top 0.406: A_TERM.2 6.35,5.08 7.49,6.22 7.49,11.05 7.55,11.11 A_I2C.5
N$14
  Top 0.406: A_TERM.1 6.35,2.54 8.05,4.24 8.05,10.41 8.09,10.46 A_I2C.6
N$17
  Top 0.406: A_I2C.10 18.64,9.8 19.05,9.4 19.05,7.62 17.53,6.1 C2.1
N$18
  Top 0.406: FTHRWNG.20 49.53,22.86 49.91,23.24 57.15,23.24 58.93,25.02 58.93,44.07 58.67,44.32 58.04,44.32 57.78,44.07 MD.11
N$20
  Top 0.406: FTHRWNG.21 46.99,22.86 48.13,24 56.13,24 57.78,25.65 MD.10
N$21
  Top 0.406: FTHRWNG.22 44.45,22.86 46.48,24.89 55.12,24.89 56.52,26.29 MD.9
N$22
  Top 0.406: MD.2 47.62,32.13 46.48,30.99 42.8,30.99 41.91,30.1 FTHRWNG.23
N$23
  Top 0.406: FTHRWNG.24 39.37,22.86 41.02,24.51 41.02,30.35 42.42,31.75 45.97,31.75 46.35,32.13 MD.1
N$25
  Top 0.406: FTHRWNG.25 36.83,22.86 40.01,26.04 40.01,30.61 42.04,32.64 45.21,32.64 45.21,43.94 45.47,44.2 46.1,44.2 46.35,43.94 MD.20
N$26
  Top 0.406: USER_1.3 11.71,42.86 LED1.A
  Top 0.813: USER_1.4 11.71,38.1 | 11.71,38.1 USER_1.3 | JP1_A.2 20.07,34.54 16.51,38.1 11.71,38.1
N$27
  Top 0.406: USER_2.4 43.79,42.86 LED2.A
  Top 0.813: USER_2.3 43.79,38.1 | 43.79,38.1 USER_2.4 | JP2_A.1 35.69,34.42 39.37,38.1 43.79,38.1
N$29
  Top 0.406: LED1.C 16.89,44.07 18.03,42.93 18.03,41.02 19.68,39.37 R_L1.1
N$30
  Top 0.406: LED2.C 38.73,44.2 37.59,43.05 37.59,41.4 35.56,39.37 R_L2.2
N$32
  Top 0.406: D_I2C.5 9.34,30.16 9.14,30.35 9.14,37.72 6.22,40.64 D_TERM.5
N$33
  Top 0.406: D_I2C.4 9.96,30.8 9.91,30.86 9.91,39.5 6.22,43.18 D_TERM.6
N$35
  Top 0.406: D_TERM.8 33.02,48.26 35.43,45.85 JP2_B.1
N$44
  Top 0.813: R_M.1 C_M2.1
N$45
  Top 0.813: D_M1.C D_M2.A 62.23,34.29 61.59,34.92 R_M.2
SCL  (via drill 0.4)
  Top 0.406: PU_SCL.2 57.78,12.7 54.61,15.88 FTHRWNG.18 54.61,18.05 v24.51,17.78 24.38,17.78 19.01,12.4 A_I2C.14 | v24.51,21.97 24.51,28.19 v25.59,29.27 28.45,32.13 28.45,40.89 28.96,41.4 I2C.3 | v21.21,30.73 20.49,31.45 D_I2C.14
  Bottom 0.406: v24.51,21.97 v24.51,17.78 | v25.59,29.27 22.67,29.27 v21.21,30.73
SDA  (via drill 0.4)
  Top 0.406: PU_SDA.2 58.42,16.51 57.15,17.78 v57.15,19.18 FTHRWNG.17 | A_I2C.15 18.64,13.05 23.75,18.16 v23.75,18.67 52.96,18.67 v53.47,19.18 | v23.75,21.08 23.75,29.21 v25.53,30.99 27.69,33.15 27.69,40.64 26.42,41.91 I2C.2 | v22.1,31.75 21.74,32.1 D_I2C.15
  Bottom 0.406: v57.15,19.18 v53.47,19.18 | v23.75,21.08 v23.75,18.67 | v25.53,30.99 25.02,30.48 23.37,30.48 v22.1,31.75
V_MOT
  Top 0.813: C_M1.1 69.85,45.72 | 69.85,45.72 74.42,45.72 74.55,45.59 | D_M1.A 69.85,45.72
  Top 1.27: 52.2,45.34 52.2,49.15 70.99,49.15 74.55,45.59 74.55,32.64 M_TERM.1
  pour Top (isolate 0.406, rank 6, no thermals): 49.91,41.27 54.36,41.27 54.36,45.21 53.47,46.1 50.8,46.1 49.91,45.21
VBOOT
  Top 0.813: D_M2.C 64.77,45.72 | 64.77,45.72 C_M1.2 | 64.77,45.72 62.99,47.5 56.52,47.5 MD.12
VCP  (via drill 0.8)
  Top 0.813: v47.62,44.96 MD.19 | C_M2.2 61.59,45.59 60.96,46.23 v60.07,46.23
  Bottom 0.813: v60.07,46.23 60.07,48.51 59.44,49.15 48.13,49.15 47.62,48.64 v47.62,44.96

### Text on the board
tPlace: V_M IN | Motor A | Motor B
tNames: U2/8 | 3.3V | SDA | SCL | GND | U1/7 | 1 | 2 | 3 | 4 | GPIO_I2C | 5 | 6 | + | - | + | + | 3.3V | - | - | ENC_1 | COM | ENC_2 | 1 | + | 2 | - | 3 | ANALOG_I2C | ENC_1 | ENC_2 | 4 | 5 | + | 3.3V | 6 | -